# Altium schematic sheet ClockGenerator.SchDoc
size A4
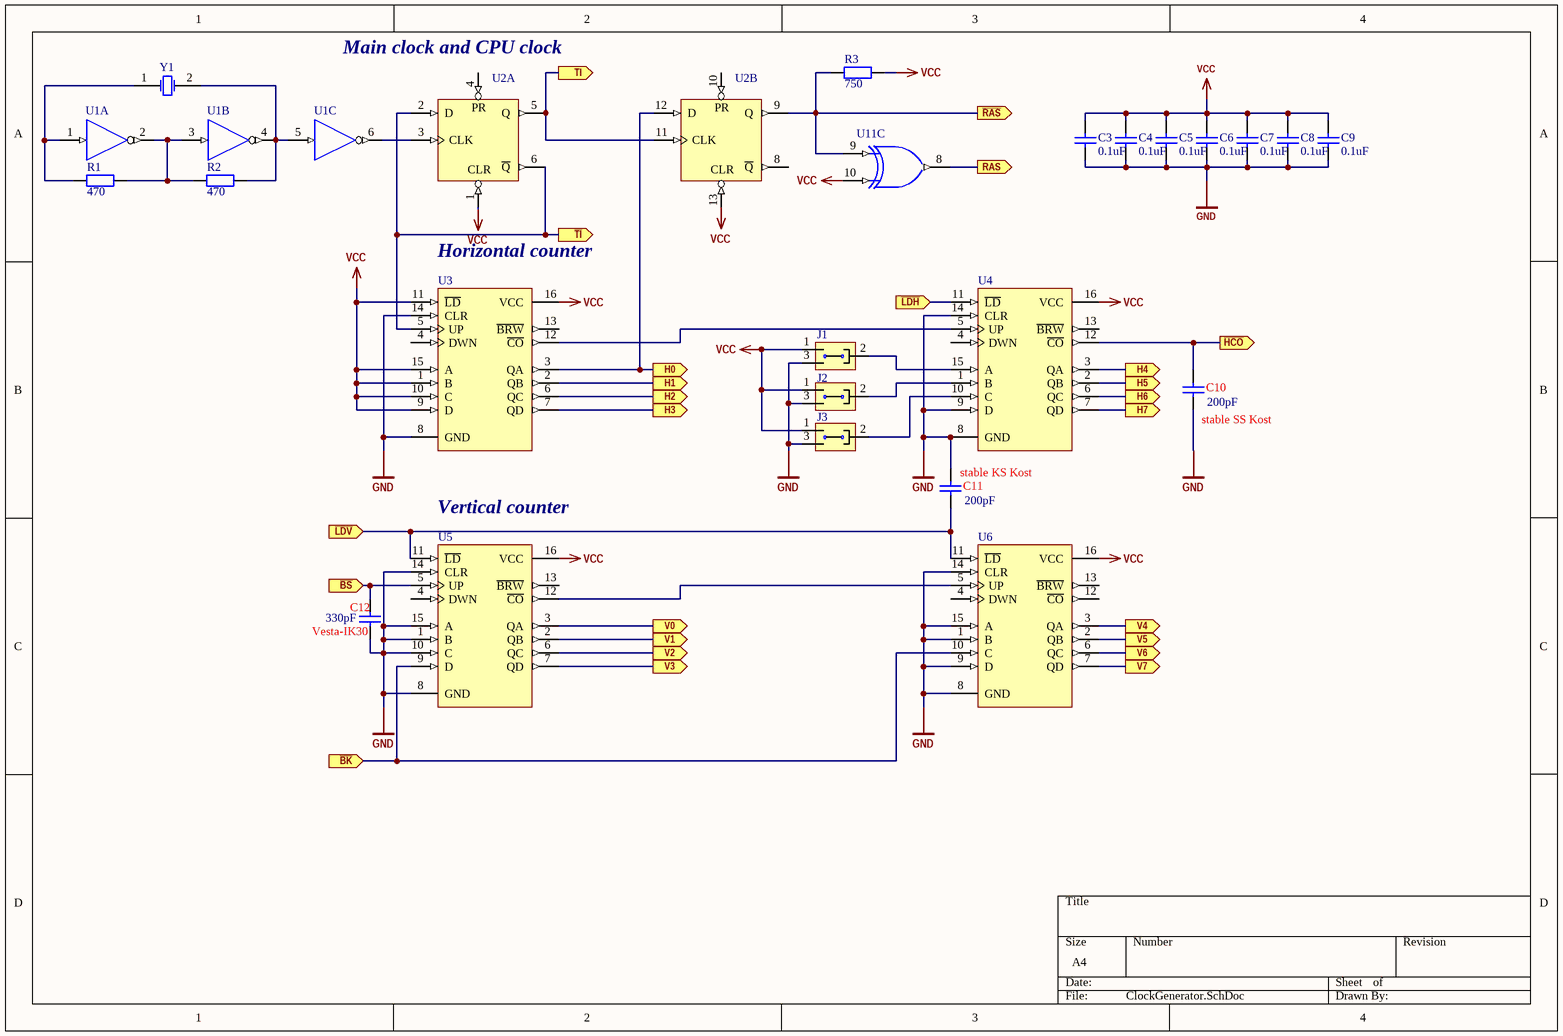
[diagram p0: ClockGenerator.SchDoc]

## Parts
C3  value 0.1uF  [RAD-0.3]  (hidden comment: Cap)
C4  value 0.1uF  [RAD-0.3]  (hidden comment: Cap)
C5  value 0.1uF  [RAD-0.3]  (hidden comment: Cap)
C6  value 0.1uF  [RAD-0.3]  (hidden comment: Cap)
C7  value 0.1uF  [RAD-0.3]  (hidden comment: Cap)
C8  value 0.1uF  [RAD-0.3]  (hidden comment: Cap)
C9  value 0.1uF  [RAD-0.3]  (hidden comment: Cap)
C10  stable SS Kost  value 200pF  [RAD-0.3]
C11  stable KS Kost  value 200pF  [RAD-0.3]
C12  Vesta-IK30  value 330pF  [RAD-0.3]
J1  Jump3  [MHDR1X3]  (value not drawn)
J2  Jump3  [MHDR1X3]  (value not drawn)
J3  Jump3  [MHDR1X3]  (value not drawn)
R1  value 470  [AXIAL-0.4]
R2  value 470  [AXIAL-0.4]
R3  value 750  [AXIAL-0.4]
U1  (no value)  [N014]  (parts A,B,C of 6)
U2  (no value)  [N014]  (parts A,B of 2)
U3  (no value)  [N016]
U4  (no value)  [N016]
U5  (no value)  [N016]
U6  (no value)  [N016]
U11  (no value)  [N014]  (part C of 4)
Y1  XTAL  [HC25U]  (value not drawn)

## Ports
H0 (out), H1 (out), H2 (out), H3 (out), H4 (out), H5 (out), H6 (out), H7 (out), RAS (out), TI (out), V0 (out), V1 (out), V2 (out), V3 (out), V4 (out), V5 (out), V6 (out), V7 (out), ~{BK} (in), ~{BS} (in), ~{HCO} (out), ~{LDH} (in), ~{LDV} (in), ~{RAS} (out), ~{TI} (out)

## Nets
GND: C3.1 C4.1 C5.1 C6.1 C7.1 C8.1 C9.1 C10.1 C11.2 C12.1 J1.3 J2.3 J3.3 U1.7(GND) U2.7(GND) U3.8(GND) U3.14(CLR) U4.8(GND) U4.9(D) U4.14(CLR) U5.1(B) U5.8(GND) U5.10(C) U5.14(CLR) U5.15(A) U6.1(B) U6.8(GND) U6.9(D) U6.14(CLR) U6.15(A) U11.7(GND)
VCC: C3.2 C4.2 C5.2 C6.2 C7.2 C8.2 C9.2 J1.1 J2.1 J3.1 R3.2 U1.14(VCC) U2.1(CLR) U2.13(CLR) U2.14(VCC) U3.1(B) U3.9(D) U3.10(C) U3.11(~{LD}) U3.15(A) U3.16(VCC) U4.16(VCC) U5.16(VCC) U6.16(VCC) U11.10(B) U11.14(VCC)
~{BK}: U5.9(D) U6.10(C) ; port ~{BK}
~{BS}: C12.2 U5.5(UP) ; port ~{BS}
H0: U2.12(D) U3.3(QA) ; port H0
H1: U3.2(QB) ; port H1
H2: U3.6(QC) ; port H2
H3: U3.7(QD) ; port H3
H4: U4.3(QA) ; port H4
H5: U4.2(QB) ; port H5
H6: U4.6(QC) ; port H6
H7: U4.7(QD) ; port H7
~{HCO}: C10.2 U4.12(~{CO}) ; port ~{HCO}
~{LDH}: U4.11(~{LD}) ; port ~{LDH}
~{LDV}: C11.1 U5.11(~{LD}) U6.11(~{LD}) ; port ~{LDV}
~{RAS}: R3.1 U2.9(Q) U11.9(A) ; port ~{RAS}
RAS: U11.8(Y) ; port RAS
~{TI}: U2.2(D) U2.6(~{Q}) U3.5(UP) ; port ~{TI}
TI: U2.5(Q) U2.11(CLK) ; port TI
V0: U5.3(QA) ; port V0
V1: U5.2(QB) ; port V1
V2: U5.6(QC) ; port V2
V3: U5.7(QD) ; port V3
V4: U6.3(QA) ; port V4
V5: U6.2(QB) ; port V5
V6: U6.6(QC) ; port V6
V7: U6.7(QD) ; port V7
NetJ1_2: J1.2 U4.15(A)
NetJ2_2: J2.2 U4.1(B)
NetJ3_2: J3.2 U4.10(C)
NetR1_1: R1.1 U1.1(A) Y1.1(OSC1)
NetR1_2: R1.2 R2.1 U1.2(Y) U1.3(A)
NetR2_2: R2.2 U1.4(Y) U1.5(A) Y1.2(OSC2)
NetU1_6: U1.6(Y) U2.3(CLK)
NetU3_12: U3.12(~{CO}) U4.5(UP)
NetU5_12: U5.12(~{CO}) U6.5(UP)

Not connected (* = marked no-connect by the designer): U2 4(PR) 8(~{Q}) 10(PR); U3 4(DWN) 13(~{BRW}); U4 4(DWN) 13(~{BRW}); U5 4(DWN) 13(~{BRW}); U6 4(DWN) 12(~{CO}) 13(~{BRW})

## Notes on the sheet
- (near U2) Main clock and CPU clock
- Horizontal counter
- Vertical counter

## Library data of the parts
C3-C12 = Cap: Capacitor; Published: 8-Jun-2000; LatestRevisionDate: 17-Jul-2002; LatestRevisionNote: Re-released for DXP Platform.; PackageReference: RAD-0.3; Publisher: Altium Limited; PackageDescription: Radial Cap, Thru-Hole; 2 Leads; 0.3 in Pin Spacing
R1-R3 = Res2: Resistor; Published: 8-Jun-2000; LatestRevisionDate: 17-Jul-2002; LatestRevisionNote: Re-released for DXP Platform.; PackageReference: AXIAL-0.4; Publisher: Altium Limited; PackageDescription: Axial Device, Thru-Hole; 2 Leads; 0.4 in Pin Spacing
U1 = SN74HC04N: Hex Inverter; Published: 8-Jun-2000; LatestRevisionDate: 04-Mar-2005; LatestRevisionNote: Stylized 3D Model Added.; DatasheetVersion: May-1997; PackageVersion: Oct-1995; PackageReference: N014; Publisher: Altium Limited; PackageDescription: DIP; 14 Leads; Row Spacing 7.62 mm; Pitch 2.54 mm; ComponentLink1Description: Manufacturer Link; ComponentLink1URL: http://www.ti.com/; ComponentLink2Description: Datasheet; ComponentLink2URL: http://www-s.ti.com/sc/ds/sn74hc04.pdf
U2 = SN74HC74N: Dual D-Type Positive-Edge-Triggered Flip-Flop with Clear and Preset; Published: 8-Jun-2000; LatestRevisionDate: 04-Mar-2005; LatestRevisionNote: Stylized 3D Model Added.; DatasheetVersion: May-1997; PackageVersion: Oct-1995; PackageReference: N014; Publisher: Altium Limited; PackageDescription: DIP; 14 Leads; Row Spacing 7.62 mm; Pitch 2.54 mm; ComponentLink1Description: Manufacturer Link; ComponentLink1URL: http://www.ti.com/; ComponentLink2Description: Datasheet; ComponentLink2URL: http://www-s.ti.com/sc/ds/sn74hc74.pdf
U3-U6 = SN74HC193N: 4-Bit Synchronous Up/Down Counter (Dual Clock with Clear); Published: 8-Jun-2000; LatestRevisionDate: 04-Mar-2005; LatestRevisionNote: Stylized 3D Model Added.; DatasheetVersion: May-1997; PackageVersion: Oct-1995; PackageReference: N016; Publisher: Altium Limited; PackageDescription: DIP; 16 Leads; Row Spacing 7.62 mm; Pitch 2.54 mm; Code_JEDEC: MS-001-BB; ComponentLink1Description: Manufacturer Link; ComponentLink1URL: http://www.ti.com/; ComponentLink2Description: Datasheet; ComponentLink2URL: http://www-s.ti.com/sc/ds/sn74hc193.pdf
U11 = SN74HC86N: Quadruple 2-Input Exclusive-OR Gate; Published: 8-Jun-2000; LatestRevisionDate: 04-Mar-2005; LatestRevisionNote: Stylized 3D Model Added.; DatasheetVersion: Aug-1999; PackageVersion: Oct-1995; PackageReference: N014; Publisher: Altium Limited; PackageDescription: DIP; 14 Leads; Row Spacing 7.62 mm; Pitch 2.54 mm; ComponentLink1Description: Manufacturer Link; ComponentLink1URL: http://www.ti.com/; ComponentLink2Description: Datasheet; ComponentLink2URL: http://www-s.ti.com/sc/ds/SN54HC86.pdf
Y1 = XTAL: Crystal Oscillator; Published: 8-Jun-2000; LatestRevisionDate: 17-Jul-2002; LatestRevisionNote: Re-released for DXP Platform.; PackageReference: R38; Publisher: Altium Limited; PackageDescription: Crystal, Thru-Hole; 2 Leads; Body 3.1 x 8.2 mm (Dia.xH)